# EAGLE design Action Buttons (EAGLE 6.5.0)
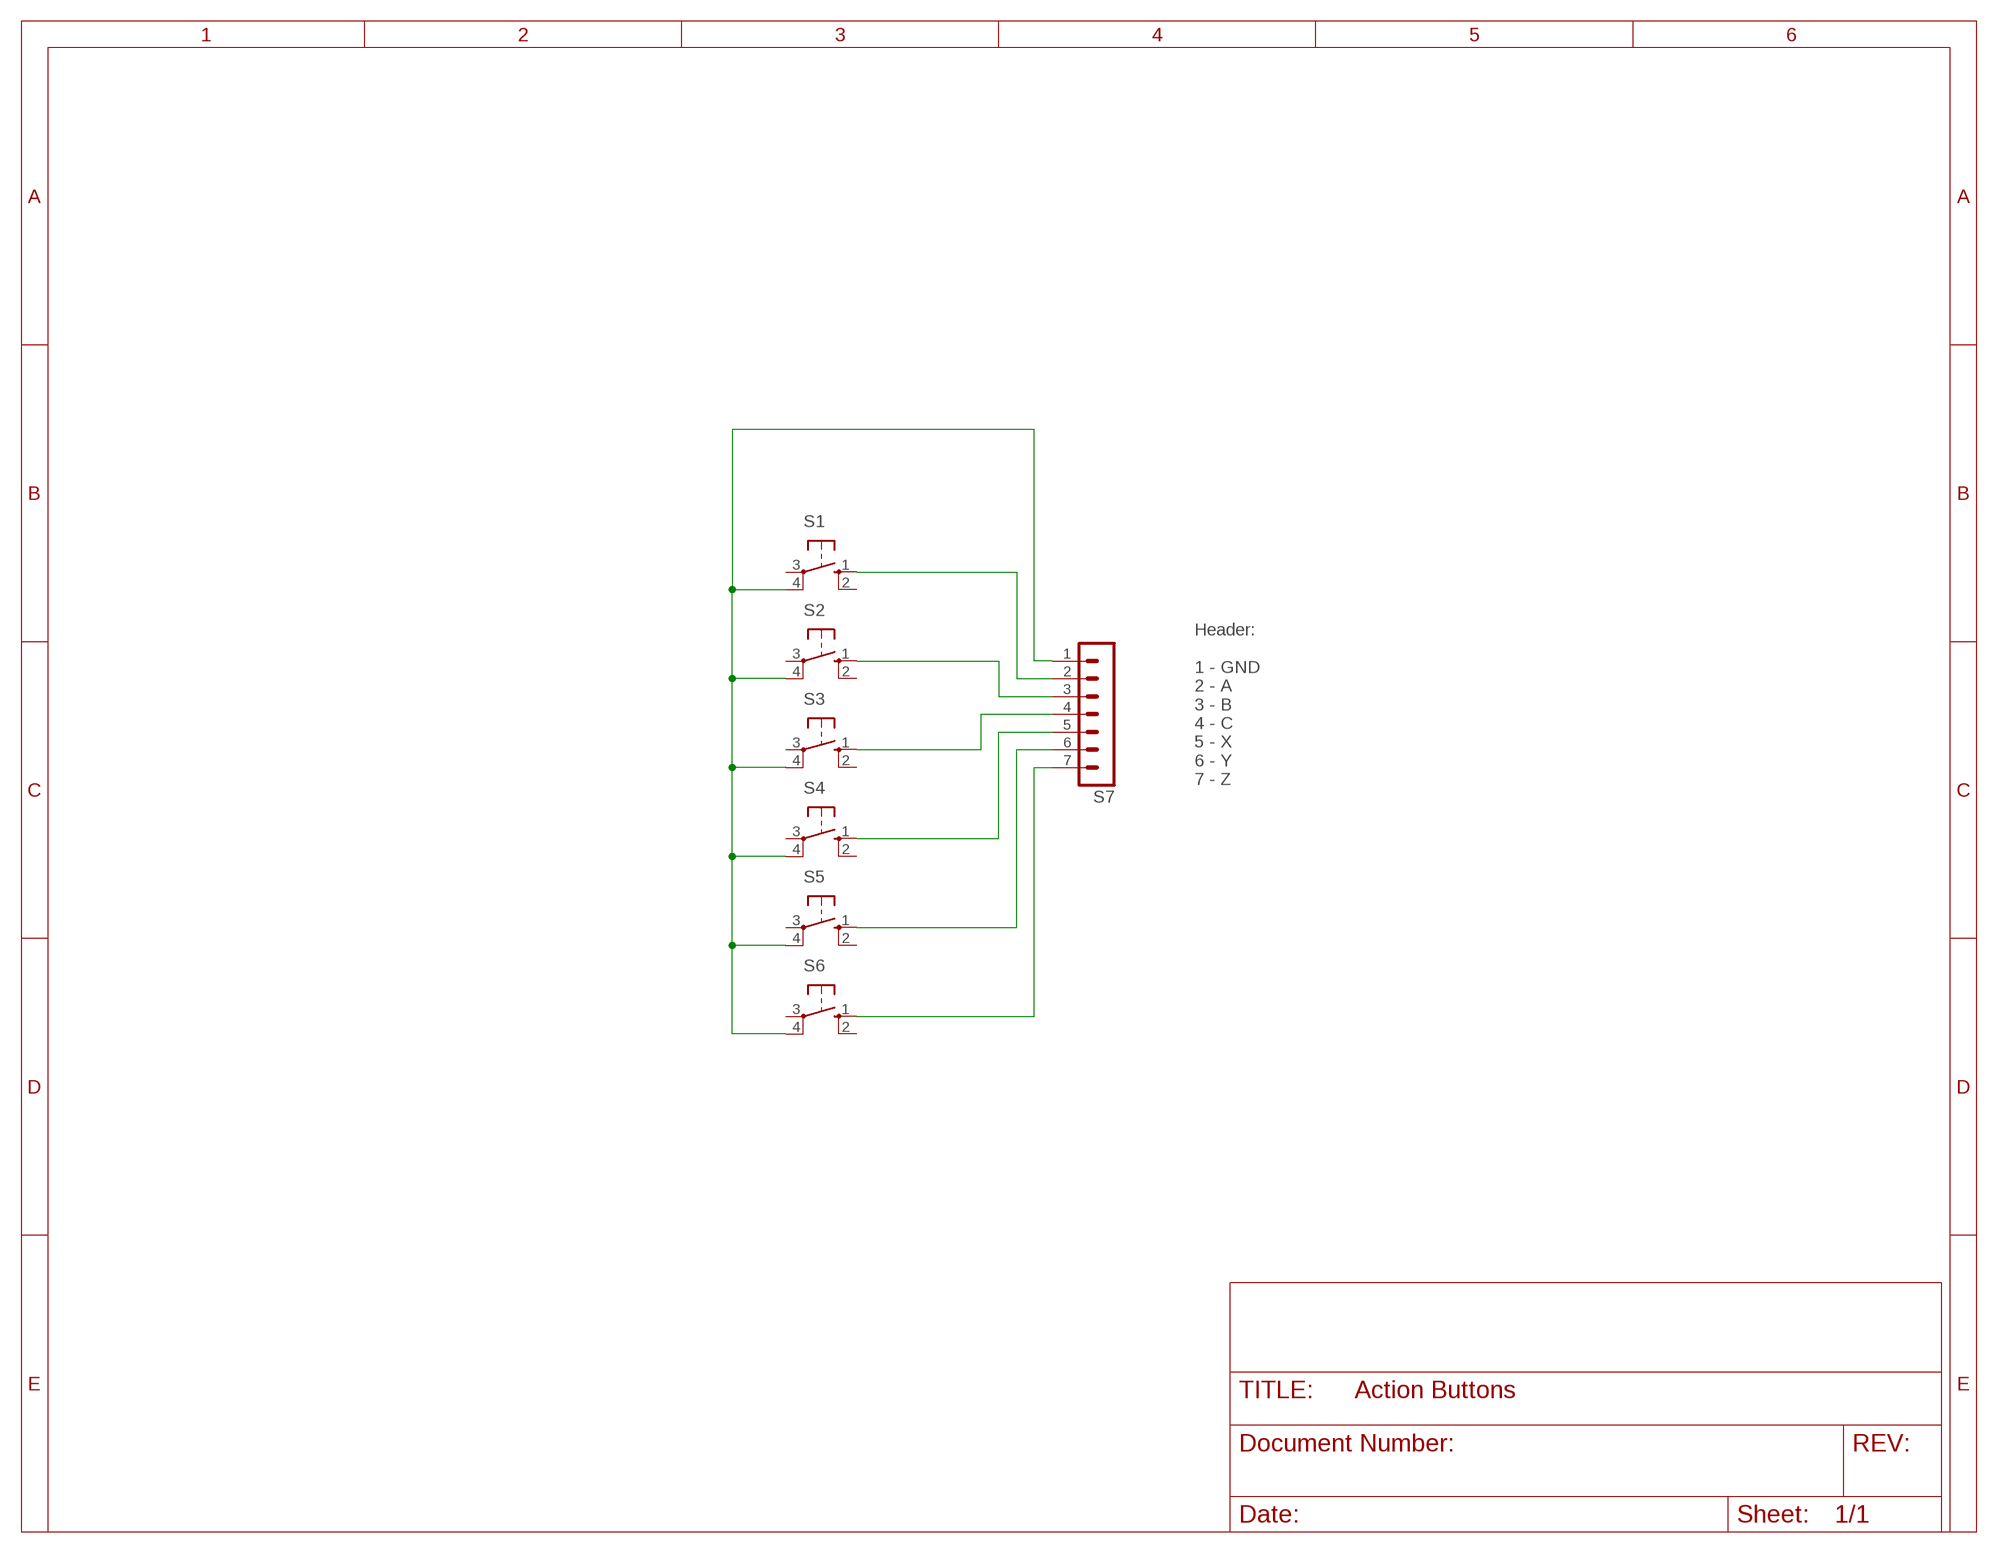
[diagram p0: schematic, sheet 1]

## Parts
S1  10-XX  [B3F-10XX]
S2  10-XX  [B3F-10XX]
S3  10-XX  [B3F-10XX]
S4  10-XX  [B3F-10XX]
S5  10-XX  [B3F-10XX]
S6  10-XX  [B3F-10XX]
S7  MA07-1  [MA07-1]

## Nets
N$1: S1.4(P1) S2.4(P1) S3.4(P1) S4.4(P1) S5.4(P1) S6.4(P1) S7.1
N$2: S1.1(S) S7.2
N$3: S2.1(S) S7.3
N$4: S3.1(S) S7.4
N$5: S4.1(S) S7.5
N$6: S5.1(S) S7.6
N$7: S6.1(S) S7.7
Unconnected: S1.2(S1) S1.3(P) S2.2(S1) S2.3(P) S3.2(S1) S3.3(P) S4.2(S1) S4.3(P) S5.2(S1) S5.3(P) S6.2(S1) S6.3(P)

## Notes on the sheet
- Header:
  
  1 - GND
  2 - A
  3 - B
  4 - C
  5 - X
  6 - Y
  7 - Z

## Library data of the parts
S1-S6 = switch-omron:10-XX: OMRON SWITCH; MPN: B3F-1000; OC_FARNELL: 176432; OC_NEWARK: 36M3542
S7 = con-lstb:MA07-1: PIN HEADER; OC_FARNELL: unknown; OC_NEWARK: unknown

## Board
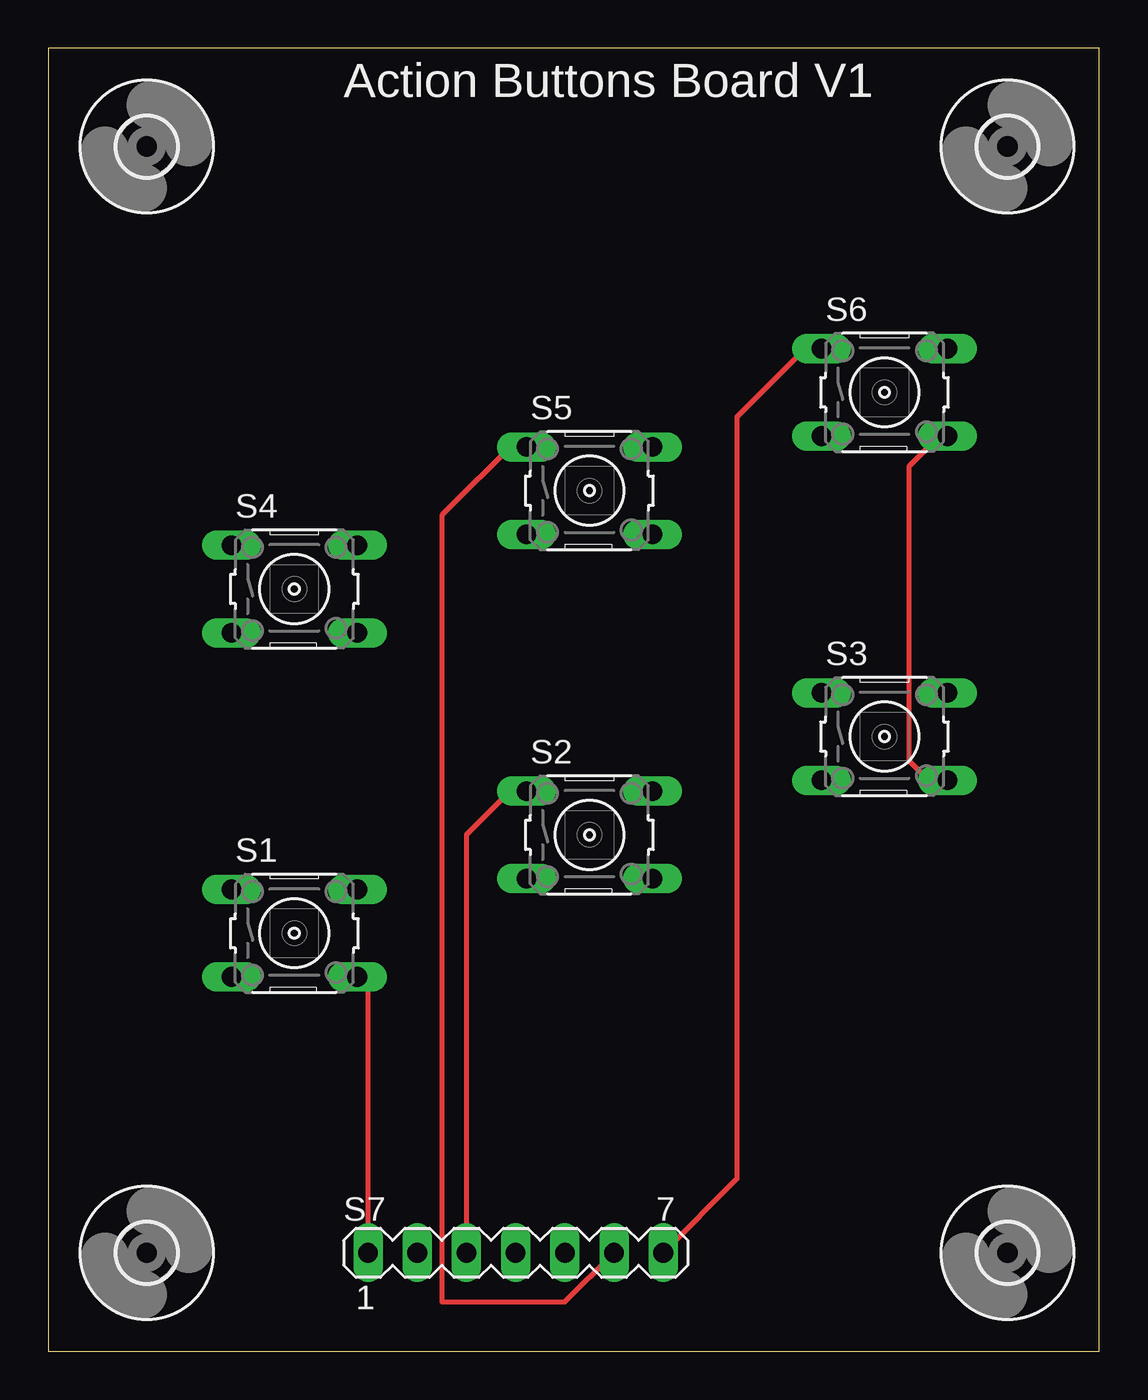
[diagram p1: board, top side]
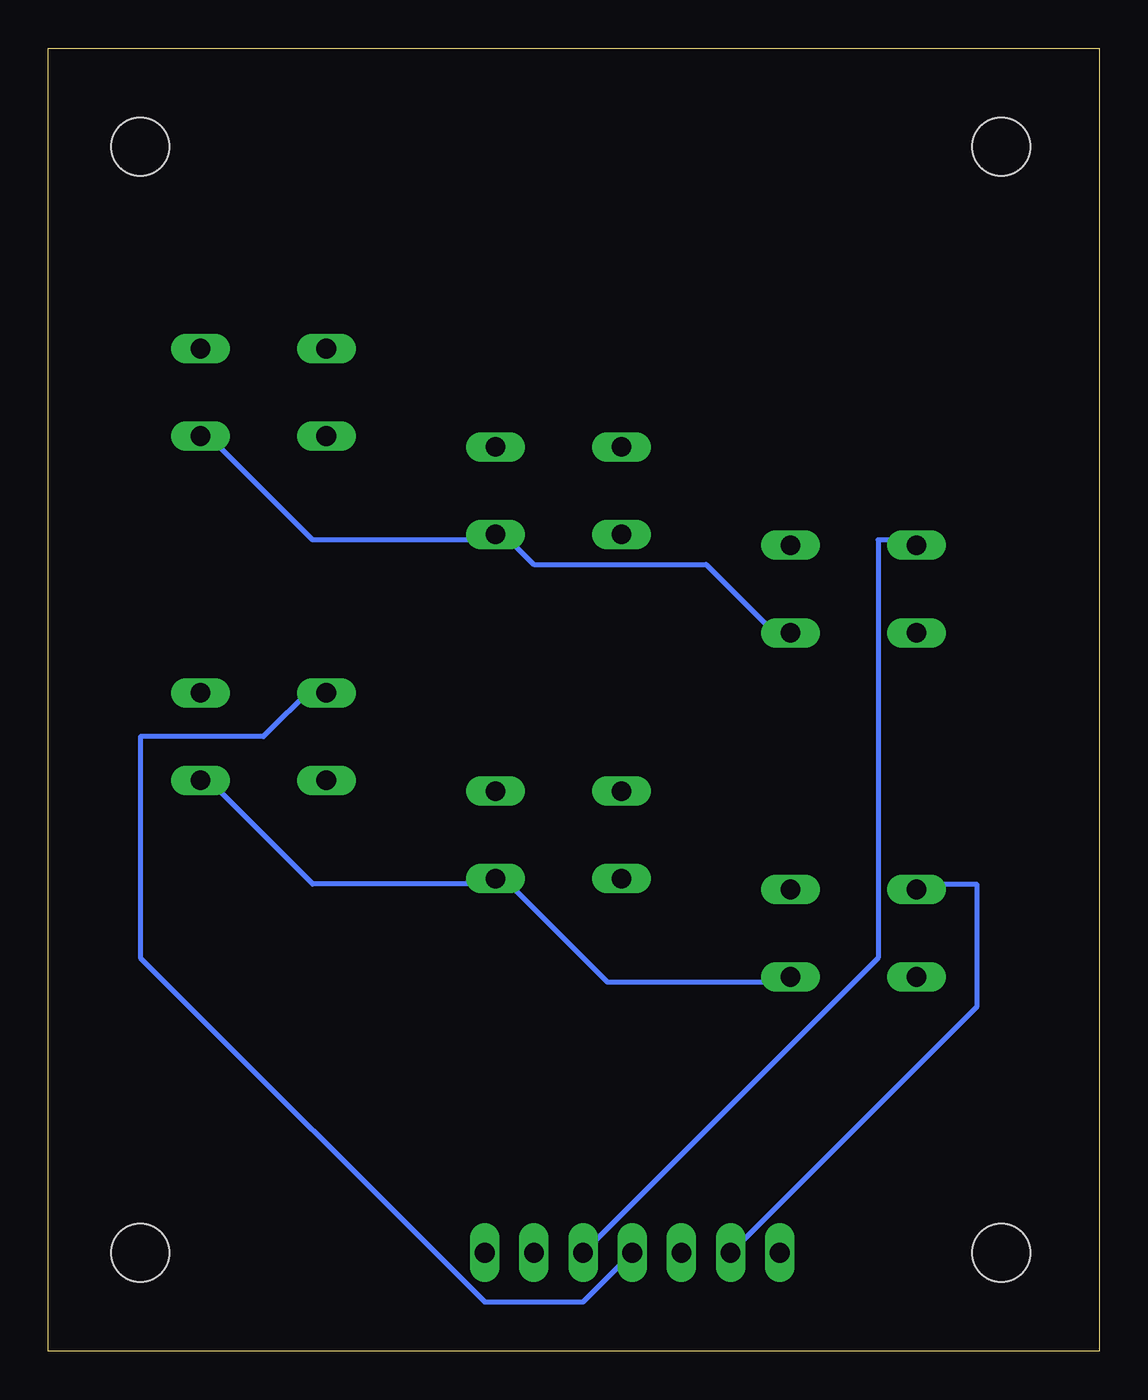
[diagram p2: board, bottom side, seen from below]

Size 54.28 x 67.3 mm. Coordinates in mm from the lower left corner, seen from the top.
Outline: 0,0 54.28,0 54.28,67.3 0,67.3 0,0
Copper layers (1*16): Top 0.035mm / dielectric 1.5mm / Bottom 0.035mm
Design rules "default": minimum track width 10mil, minimum drill 24mil, track to track 8mil, track to pad 8mil, pad to pad 8mil, via to via 8mil, smd to smd 8mil, copper to edge 40mil, drill to drill 8mil, minimum pad ring 10mil, minimum via ring 8mil, stop-mask expansion 4mil, vias tented up to drill 0mil, thermal gap 10mil

### Footprints (pad centres in the part's own frame; a part is rotated, then mirrored left to right if it is on the bottom)
B3F-10XX = drill 1.016 long: 1 -3.251,2.261; 2 3.251,2.261; 3 -3.251,-2.261; 4 3.251,-2.261
MA07-1 = drill 1.016 long: 1 -7.62,0; 2 -5.08,0; 3 -2.54,0; 4 0,0; 5 2.54,0; 6 5.08,0; 7 7.62,0
3,0 = hole 3: 0,0

### Placement (x,y rotation side)
S1  12.7,21.59 0 top
S2  27.94,26.67 0 top
S3  43.18,31.75 0 top
S4  12.7,39.37 0 top
S5  27.94,44.45 0 top
S6  43.18,49.53 0 top
S7  24.13,5.08 0 top
U$1  [3,0]  5.08,5.08 0 top
U$2  [3,0]  49.53,5.08 0 top
U$3  [3,0]  49.53,62.23 0 top
U$4  [3,0]  5.08,62.23 0 top

### Tracks (layer width: path | path; a pad name or v marks a point on that pad's centre or on a via)
N$1
  Top 0.254: S7.1 16.51,19.05 S1.4 | S6.4 45.72,46.99 44.45,45.72 44.45,30.48 45.72,29.21 S3.4
  Bottom 0.254: S4.4 16.51,36.83 20.32,40.64 29.21,40.64 30.48,41.91 S5.4 31.75,41.91 40.64,41.91 45.72,46.99 S6.4 | S1.4 16.51,19.05 25.4,19.05 30.48,24.13 S2.4 31.75,24.13 40.64,24.13 45.72,29.21 S3.4
N$2
  Bottom 0.254: S7.2 6.35,17.78 6.35,24.13 8.89,24.13 S1.1
N$3
  Top 0.254: S7.3 21.59,26.67 24.13,29.21 S2.1
N$4
  Bottom 0.254: S7.4 26.67,2.54 31.75,2.54 49.53,20.32 49.53,31.75 43.18,31.75 40.64,34.29 S3.1
N$5
  Bottom 0.254: S7.5 11.43,20.32 11.43,41.91 10.16,41.91 S4.1
N$6
  Top 0.254: S7.6 26.67,2.54 20.32,2.54 20.32,43.18 24.13,46.99 S5.1
N$7
  Top 0.254: S7.7 35.56,8.89 35.56,48.26 39.37,52.07 S6.1

### Text on the board
tNames: Action Buttons Board V1